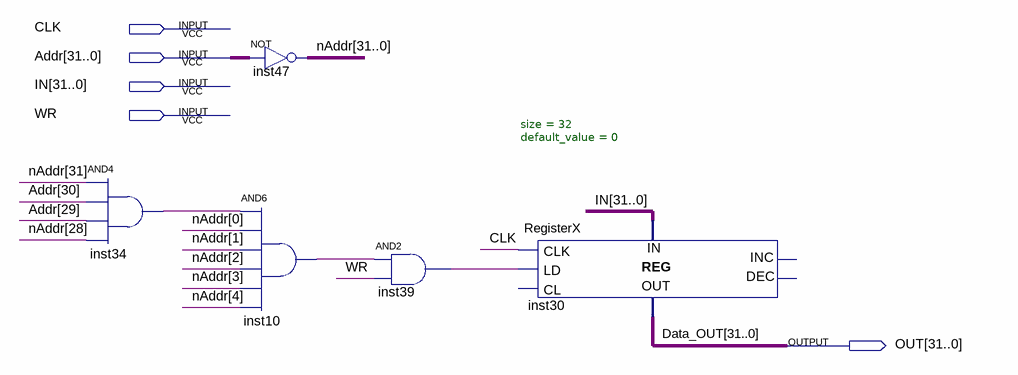
[diagram p0: schematic sheet]
// Quartus schematic KPHex.bdf as structural Verilog: 5 symbols, 5 pins
module KPHex (
  input  CLK,
  input  [31:0] Addr,
  input  [31:0] IN,
  input  WR,
  output [31:0] OUT
);

  wire inst10_out, inst34_out, inst39_out;
  wire [31:0] nAddr;

  and inst34 (inst34_out, nAddr[31], Addr[30], Addr[29], nAddr[28]);
  and inst10 (inst10_out, inst34_out, nAddr[0], nAddr[1], nAddr[2], nAddr[3], nAddr[4]);
  assign nAddr = ~Addr;  // NOT inst47, 32 bits wide
  and inst39 (inst39_out, inst10_out, WR);
  RegisterX #(.size(32), .default_value(0)) inst30 (
    .CLK(CLK), .LD(inst39_out), .DATA_IN(IN), .DATA_OUT(OUT));  // open: CL, INC, DEC

  // Other names for the same wires on the sheet: Data_OUT[31:0] = OUT
endmodule
